# EAGLE design IOBoard-6-64 (EAGLE 4.13)
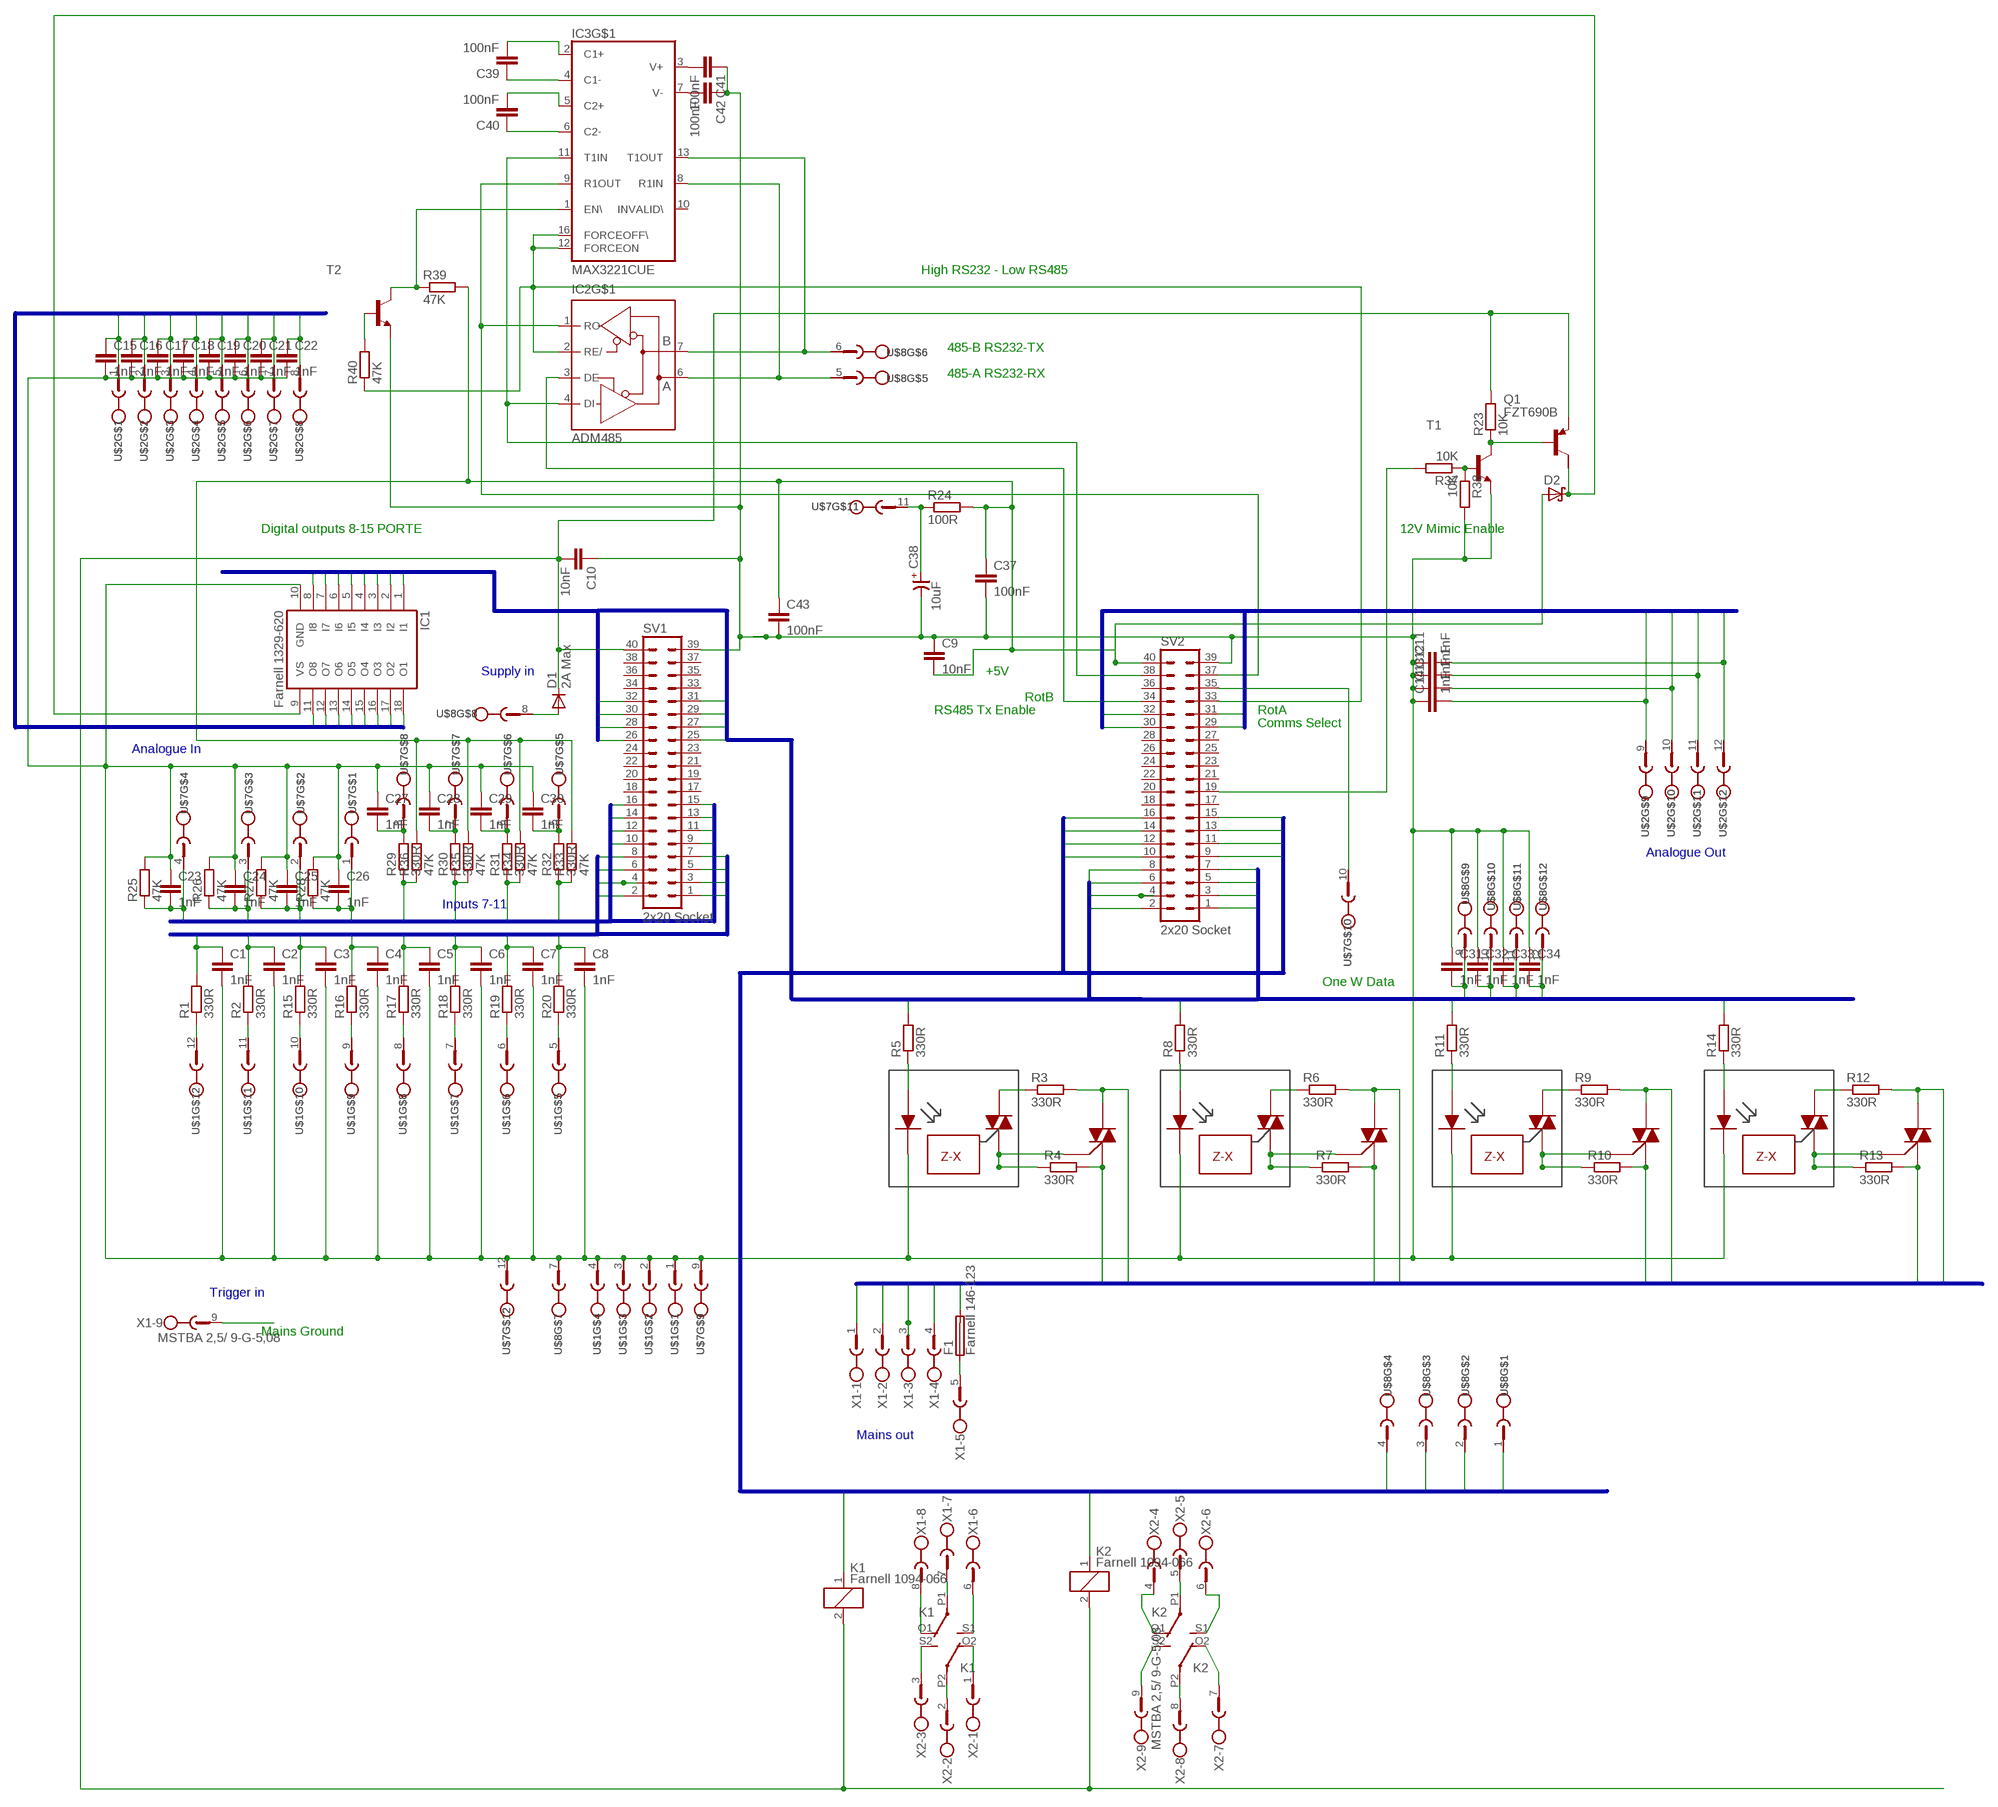
[diagram p0: schematic, sheet 1]

## Parts
C1  1nF  C-EUC1206  [C1206]
C2  1nF  C-EUC1206  [C1206]
C3  1nF  C-EUC1206  [C1206]
C4  1nF  C-EUC1206  [C1206]
C5  1nF  C-EUC1206  [C1206]
C6  1nF  C-EUC1206  [C1206]
C7  1nF  C-EUC1206  [C1206]
C8  1nF  C-EUC1206  [C1206]
C9  10nF  C-EUC1206  [C1206]
C10  10nF  C-EUC1206  [C1206]
C11  1nF  C-EUC1206  [C1206]
C12  1nF  C-EUC1206  [C1206]
C13  1nF  C-EUC1206  [C1206]
C14  1nF  C-EUC1206  [C1206]
C15  1nF  C-EUC1206  [C1206]
C16  1nF  C-EUC1206  [C1206]
C17  1nF  C-EUC1206  [C1206]
C18  1nF  C-EUC1206  [C1206]
C19  1nF  C-EUC1206  [C1206]
C20  1nF  C-EUC1206  [C1206]
C21  1nF  C-EUC1206  [C1206]
C22  1nF  C-EUC1206  [C1206]
C23  1nF  C-EUC1206  [C1206]
C24  1nF  C-EUC1206  [C1206]
C25  1nF  C-EUC1206  [C1206]
C26  1nF  C-EUC1206K  [C1206K]
C27  1nF  C-EUC1206  [C1206]
C28  1nF  C-EUC1206  [C1206]
C29  1nF  C-EUC1206  [C1206]
C30  1nF  C-EUC1206  [C1206]
C31  1nF  C-EUC1206K  [C1206K]
C32  1nF  C-EUC1206K  [C1206K]
C33  1nF  C-EUC1206K  [C1206K]
C34  1nF  C-EUC1206K  [C1206K]
C37  100nF  C-EUC1206  [C1206]
C38  10uF  CP-3216  [3216/T]
C39  100nF  C-EUC1206  [C1206]
C40  100nF  C-EUC1206  [C1206]
C41  100nF  C-EUC1206  [C1206]
C42  100nF  C-EUC1206  [C1206]
C43  100nF  C-EUC1206  [C1206]
D1  2A Max  DIODE-DO214BA  [DO-214BA]
D2  SCHOTTKY-DIODE  [SOD123]
DRV1  MOC3042  OPTRIAC  [DIL06]
DRV2  MOC3042  OPTRIAC  [DIL06]
DRV3  MOC3042  OPTRIAC  [DIL06]
DRV4  MOC3042  OPTRIAC  [DIL06]
F1  Farnell 146-123  SHK20L  [SHK20L]
IC1  Farnell 1329-620  UDN2981AD  [SO20W]
IC2  ADM485  MAX481CSA  [SO08]
IC3  MAX3221CUE  [TSSOP16]
K1  Farnell 1094-066  G2R2  [G2R2]
K2  Farnell 1094-066  G2R2  [G2R2]
Q1  FZT690B  FZT753SMD  [SOT223]
R1  330R  R-EU_M1206  [M1206]
R2  330R  R-EU_M1206  [M1206]
R3  330R  R-EU_M1206  [M1206]
R4  330R  R-EU_M1206  [M1206]
R5  330R  R-EU_M1206  [M1206]
R6  330R  R-EU_M1206  [M1206]
R7  330R  R-EU_M1206  [M1206]
R8  330R  R-EU_M1206  [M1206]
R9  330R  R-EU_M1206  [M1206]
R10  330R  R-EU_M1206  [M1206]
R11  330R  R-EU_M1206  [M1206]
R12  330R  R-EU_M1206  [M1206]
R13  330R  R-EU_M1206  [M1206]
R14  330R  R-EU_M1206  [M1206]
R15  330R  R-EU_M1206  [M1206]
R16  330R  R-EU_M1206  [M1206]
R17  330R  R-EU_M1206  [M1206]
R18  330R  R-EU_M1206  [M1206]
R19  330R  R-EU_M1206  [M1206]
R20  330R  R-EU_M1206  [M1206]
R23  10K  R-EU_R1206  [R1206]
R24  100R  R-EU_R1206  [R1206]
R25  47K  R-EU_R1206  [R1206]
R26  47K  R-EU_R1206  [R1206]
R27  47K  R-EU_R1206  [R1206]
R28  47K  R-EU_R1206  [R1206]
R29  330R  R-EU_M1206  [M1206]
R30  330R  R-EU_M1206  [M1206]
R31  330R  R-EU_M1206  [M1206]
R32  330R  R-EU_M1206  [M1206]
R33  47K  R-EU_M1206  [M1206]
R34  47K  R-EU_M1206  [M1206]
R35  47K  R-EU_M1206  [M1206]
R36  47K  R-EU_M1206  [M1206]
R37  10K  R-EU_R1206  [R1206]
R38  10K  R-EU_R1206  [R1206]
R39  47K  R-EU_R1206  [R1206]
R40  47K  R-EU_R1206  [R1206]
SV1  2x20 Socket  MA20-2  [MA20-2]
SV2  2x20 Socket  MA20-2  [MA20-2]
T1  BCW60-NPN-SOT23-BEC  [SOT23-BEC]
T2  BCW60-NPN-SOT23-BEC  [SOT23-BEC]
U$1  MC 1,5/12-G-3,5  MC123.5PITCH  [MC12-3.5]
U$2  MC 1,5/12-G-3,5  MC123.5PITCH  [MC12-3.5]
U$3  BTA08-600CW  BTA08TO220AV  [TO220AV]
U$4  BTA08-600CW  BTA08TO220AV  [TO220AV]
U$5  BTA08-600CW  BTA08TO220AV  [TO220AV]
U$6  BTA08-600CW  BTA08TO220AV  [TO220AV]
U$7  MC 1,5/12-G-3,5  MC123.5PITCH  [MC12-3.5]
U$8  MC 1,5/12-G-3,5  MC123.5PITCH  [MC12-3.5]
X1  MSTBA 2,5/ 9-G-5,08  MSTBV9  [MSTBV9]
X2  MSTBA 2,5/ 9-G-5,08  MSTBV9  [MSTBV9]

## Nets
1WIREDATA: SV2.35 U$7.10
ANALOGUEIN0: C26.2 R28.1 SV1.9 U$7.1
ANALOGUEIN1: C25.2 R27.1 SV1.10 U$7.2
ANALOGUEIN2: C24.2 R26.1 SV1.11 U$7.3
ANALOGUEIN3: C23.2 R25.1 SV1.12 U$7.4
ANOUT0: C14.2 SV2.29 U$2.9
ANOUT1: C13.2 SV2.30 U$2.10
ANOUT2: C12.2 SV2.31 U$2.11
ANOUT3: C11.2 SV2.32 U$2.12
B4FUSE [Mains in]: F1.1A X1.5
DINPUTS0: C1.1 R1.2 SV1.1
DINPUTS1: C2.1 R2.2 SV1.2
DINPUTS2: C3.1 R15.2 SV1.3
DINPUTS3: C4.1 R16.2 SV1.4
DINPUTS4: C5.1 R17.2 SV1.5
DINPUTS5: C6.1 R18.2 SV1.6
DINPUTS6: C7.1 R19.2 SV1.7
DINPUTS7: C8.1 R20.2 SV1.8
DOUTPUTS0: R5.2 SV2.1
DOUTPUTS1: R8.2 SV2.2
DOUTPUTS2: R11.2 SV2.3
DOUTPUTS3: R14.2 SV2.4
DOUTPUTS4: C34.2 SV2.5 U$8.12
DOUTPUTS5: C33.2 SV2.6 U$8.11
DOUTPUTS6: C32.2 SV2.7 U$8.10
DOUTPUTS7: C31.2 SV2.8 U$8.9
DOUTPUTS8: IC1.1(I1) SV1.25
DOUTPUTS9: IC1.2(I2) SV1.26
DOUTPUTS10: IC1.3(I3) SV1.27
DOUTPUTS11: IC1.4(I4) SV1.28
DOUTPUTS12: IC1.5(I5) SV1.29
DOUTPUTS13: IC1.6(I6) SV1.30
DOUTPUTS14: IC1.7(I7) SV1.31
DOUTPUTS15: IC1.8(I8) SV1.32
F0 [MainsPower]: R4.2 U$3.T1(MT1) X1.1
F1 [MainsPower]: R7.2 U$4.T1(MT1) X1.2
F2 [MainsPower]: R10.2 U$5.T1(MT1) X1.3
F3 [MainsPower]: R13.2 U$6.T1(MT1) X1.4
GND: C1.2 C2.2 C3.2 C4.2 C5.2 C6.2 C7.2 C8.2 C9.1 C10.1 C11.1 C12.1 C13.1 C14.1 C15.2 C16.2 C17.2 C18.2 C19.2 C20.2 C21.2 C22.2 C23.1 C24.1 C25.1 C26.1 C27.1 C28.1 C29.1 C30.1 C31.1 C32.1 C33.1 C34.1 C37.2 C38.- C41.1 C42.1 C43.2 DRV1.2(CATH) DRV2.2(CATH) DRV3.2(CATH) DRV4.2(CATH) IC1.10(GND) R25.2 R26.2 R27.2 R28.2 R38.2 SV1.39 SV2.39 T1.E T2.E U$1.1 U$1.2 U$1.3 U$1.4 U$7.9 U$7.12 U$8.7
LIVE [Mains in]: F1.2A R3.2 R6.2 R9.2 R12.2 U$3.T2(MT2) U$4.T2(MT2) U$5.T2(MT2) U$6.T2(MT2)
MGND: X1.9
MIMICS0: C15.1 IC1.18(O1) U$2.1
MIMICS1: C16.1 IC1.17(O2) U$2.2
MIMICS2: C17.1 IC1.16(O3) U$2.3
MIMICS3: C18.1 IC1.15(O4) U$2.4
MIMICS4: C19.1 IC1.14(O5) U$2.5
MIMICS5: C20.1 IC1.13(O6) U$2.6
MIMICS6: C21.1 IC1.12(O7) U$2.7
MIMICS7: C22.1 IC1.11(O8) U$2.8
N$1 [12VSupply]: D1.A U$8.8
N$2: C38.+ R24.1 U$7.11
N$3: C27.2 R29.2 U$7.8
N$4: C28.2 R30.2 U$7.7
N$5: R1.1 U$1.12
N$6: R2.1 U$1.11
N$7: C29.2 R31.2 U$7.6
N$8: C30.2 R32.2 U$7.5
N$9: R15.1 U$1.10
N$10: R16.1 U$1.9
N$11: R17.1 U$1.8
N$12: IC2.7(B) IC3.13(T1OUT) U$8.6
N$13: IC2.6(A) IC3.8(R1IN) U$8.5
N$14: R18.1 U$1.7
N$15: R19.1 U$1.6
N$16: R20.1 U$1.5
N$17: IC2.1(RO) IC3.9(R1OUT) SV2.37
N$18: IC2.4(DI) IC3.11(T1IN) SV2.38
N$19: DRV1.6(MT2) R3.1
N$20: C41.2 IC3.3(V+)
N$21: C42.2 IC3.7(V-)
N$22: C39.1 IC3.4(C1-)
N$23: DRV1.4(MT1) R4.1 U$3.G(GATE)
N$24: DRV1.1(A) R5.1
N$25: DRV2.6(MT2) R6.1
N$26: C40.1 IC3.6(C2-)
N$27: C40.2 IC3.5(C2+)
N$28: DRV2.4(MT1) R7.1 U$4.G(GATE)
N$29: DRV2.1(A) R8.1
N$30: DRV3.6(MT2) R9.1
N$31: C39.2 IC3.2(C1+)
N$32: IC2.2(RE/) IC3.12(FORCEON) IC3.16(FORCEOFF\) R40.1
N$34: DRV3.4(MT1) R10.1 U$5.G(GATE)
N$35: DRV3.1(A) R11.1
N$36: DRV4.6(MT2) R12.1
N$39: DRV4.4(MT1) R13.1 U$6.G(GATE)
N$40: DRV4.1(A) R14.1
N$41 [12VSupply]: Q1.1(B) R23.1 T1.C
N$42: R37.1 R38.1 T1.B
N$43 [5VSuppy]: D2.C IC1.9(VS) Q1.2(C)
N$44: IC3.1(EN\) R39.1 T2.C
N$45 [12VSupply]: R37.2 SV2.19
N$46: R40.2 T2.B
OC0: SV2.9 U$8.4
OC1: SV2.10 U$8.3
OC2: SV2.11 U$8.2
OC3: SV2.12 U$8.1
OC4: K1.1 SV2.13
OC5: K2.1 SV2.14
OC6: SV2.15
OC7: SV2.16
R1P1COM [Relay]: K1.P1(2:P) X1.7
R1P1NC [Relay]: K1.O1(2:O) X1.8
R1P1NO [Relay]: K1.S1(2:S) X1.6
R1P2COM [Relay]: K1.P2(3:P) X2.2
R1P2NC [Relay]: K1.O2(3:O) X2.1
R1P2NO [Relay]: K1.S2(3:S) X2.3
R2P1COM [Relay]: K2.P1(2:P) X2.5
R2P1NC [Relay]: K2.O1(2:O) X2.4
R2P1NO [Relay]: K2.S1(2:S) X2.6
R2P2COM [Relay]: K2.P2(3:P) X2.8
R2P2NC [Relay]: K2.O2(3:O) X2.7
R2P2NO [Relay]: K2.S2(3:S) X2.9
ROTA: SV2.33
ROTB: IC2.3(DE) SV2.34
SPARE0: R32.1 R33.1 SV1.13
SPARE1: R31.1 R34.1 SV1.14
SPARE2: R30.1 R35.1 SV1.15
SPARE3: R29.1 R36.1 SV1.16
V12 [12VSupply]: C10.2 D1.C K1.2 K2.2 Q1.3(E) R23.2 SV1.40
VDD [5VSuppy]: C9.2 C37.1 C43.1 D2.A R24.2 R33.2 R34.2 R35.2 R36.2 R39.2 SV2.40
Unconnected: IC3.10(INVALID\) Q1.4(C/) SV1.17 SV1.18 SV1.19 SV1.20 SV1.21 SV1.22 SV1.23 SV1.24 SV1.33 SV1.34 SV1.35 SV1.36 SV1.37 SV1.38 SV2.17 SV2.18 SV2.20 SV2.21 SV2.22 SV2.23 SV2.24 SV2.25 SV2.26 SV2.27 SV2.28 SV2.36

## Buses
MSW,LIVE,F[0..3]
DOUTPUTS[0..15]
OC[0..7]
DINPUTS[0..7]
ANOUT[0..3]
ANALOGUEIN[0..3],SPARE[0..3]
MIMICS[0..7]

## Notes on the sheet
- High RS232 - Low RS485
- 485-B RS232-TX
- 485-A RS232-RX
- Digital outputs 8-15 PORTE | 12V Mimic Enable
- Supply in | +5V
- RotB
- RS485 Tx Enable | RotA
- Comms Select
- Analogue In
- Analogue Out
- Inputs 7-11
- One W Data
- Trigger in
- Mains Ground
- Mains out

## Power pins joined to a net without a drawn wire
GND: IC2.5(GND) IC3.14(P:GND)
VDD: IC2.8(VDD) IC3.15(P:VDD)

## Library data of the parts
C1-C34 C37 C39-C43 = rcl:C-EU: CAPACITOR, European symbol
C38 = cap-master:CP-: POLARIZED CAP
D1 = diode:DIODE-: DIODE
D2 = diode:SCHOTTKY-DIODE: Schottky Diode
DRV1-DRV4 = my-optocoupler:OPTRIAC
F1 = fuse:SHK20L: FUSE HOLDER 5 x 20 mm, SH contact, SHH1 Schukat, E1073 Buerklin
IC1 = uln-udn:UDN2981A: DRIVER ARRAY
IC2 = maxim:MAX481CSA: RS485 TRANSEIVER
IC3 = maxim-8:MAX3221*: RS-232 Transceivers with AutoShutdown 1µA Supply-Current, True +3V to +5.5V http://dbserv.maxim-ic.com/
K1 K2 = relay:G2R2: RELAY 2 x switch, Omron
Q1 = transistor-pnp:FZT753SMD: PNP Transistor
R1-R20 R23-R40 = rcl:R-EU_: RESISTOR, European symbol
SV1 SV2 = con-lstb:MA20-2: PIN HEADER
T1 T2 = transistor:*-NPN-: NPN Transistror
U$1 U$2 U$7 U$8 = con-phoenix-381_l:MC12
U$3-U$6 = my-optocoupler:BTA08
X1 X2 = con-phoenix-508:MSTBV9: PHOENIX

## Net classes
1 MainsPower: width 1.524 mm, drill 0.61 mm
2 Relay: width 1.016 mm, drill 0.61 mm
3 Mains in: width 1.524 mm, drill 0.813 mm
4 12VSupply: width 0.508 mm
5 5VSuppy: width 0.305 mm

## Board
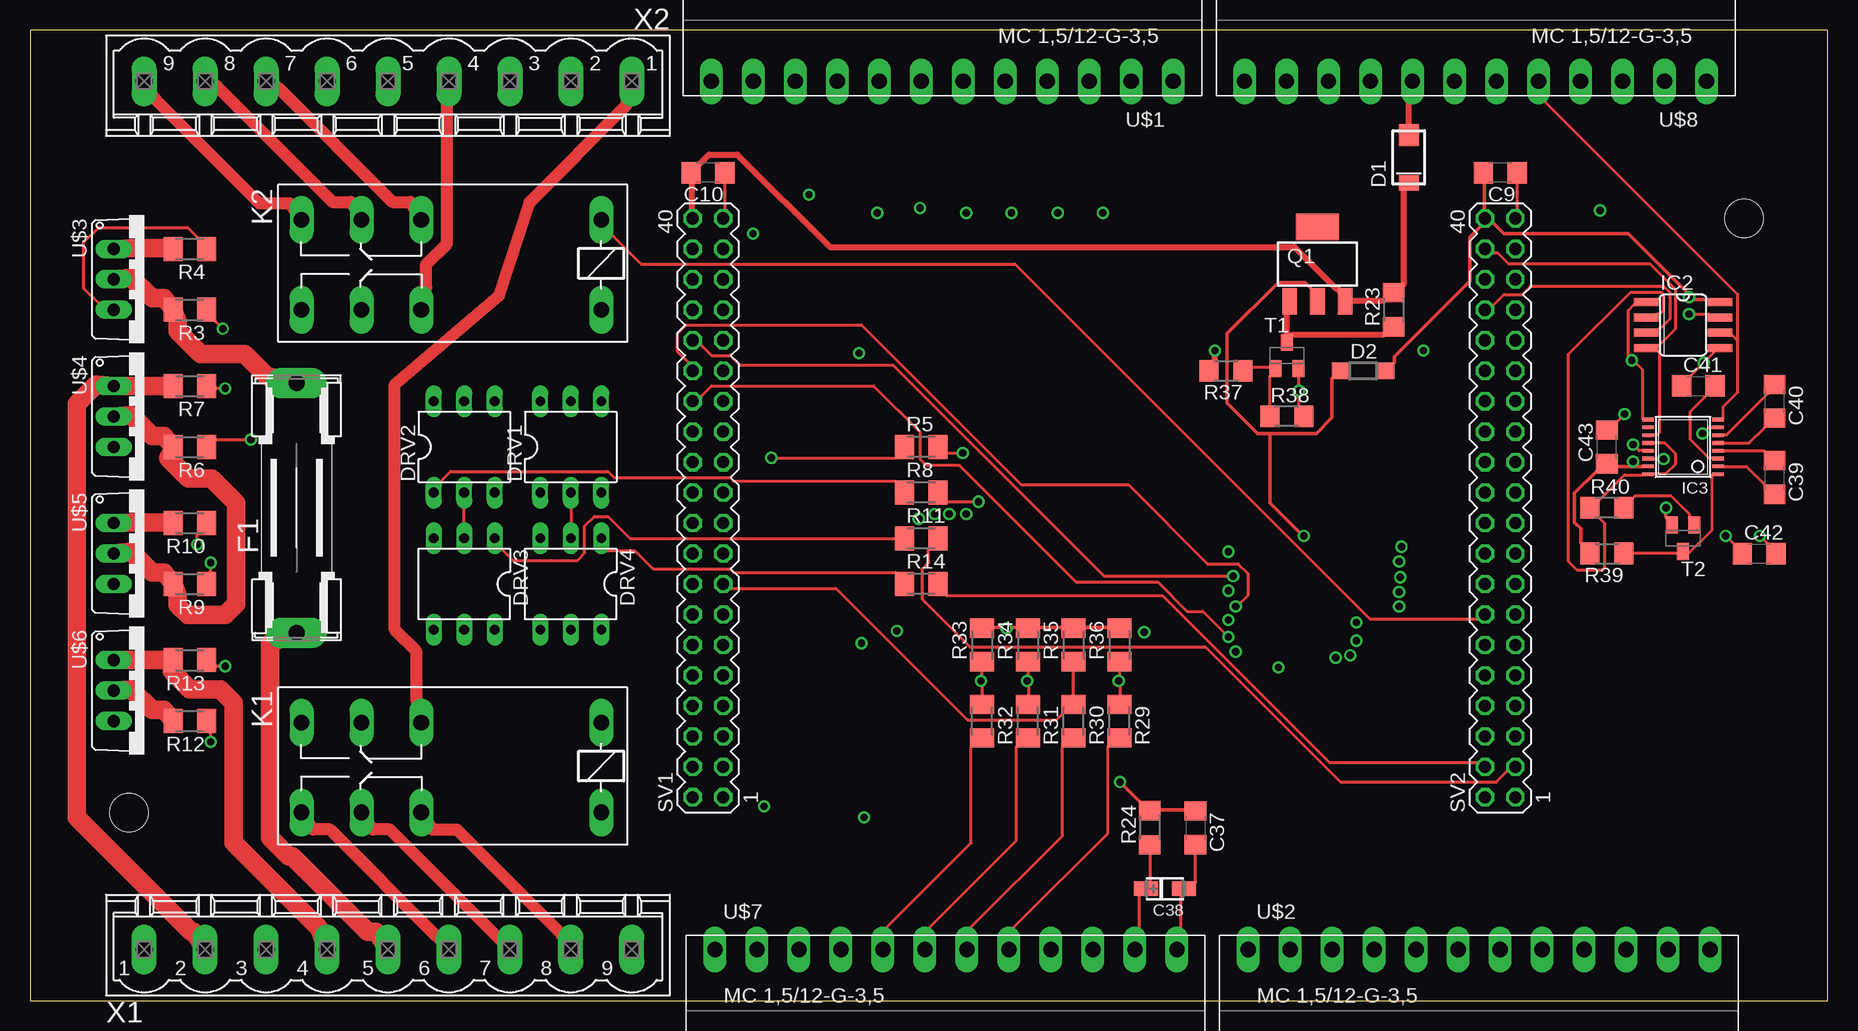
[diagram p1: board, top side]
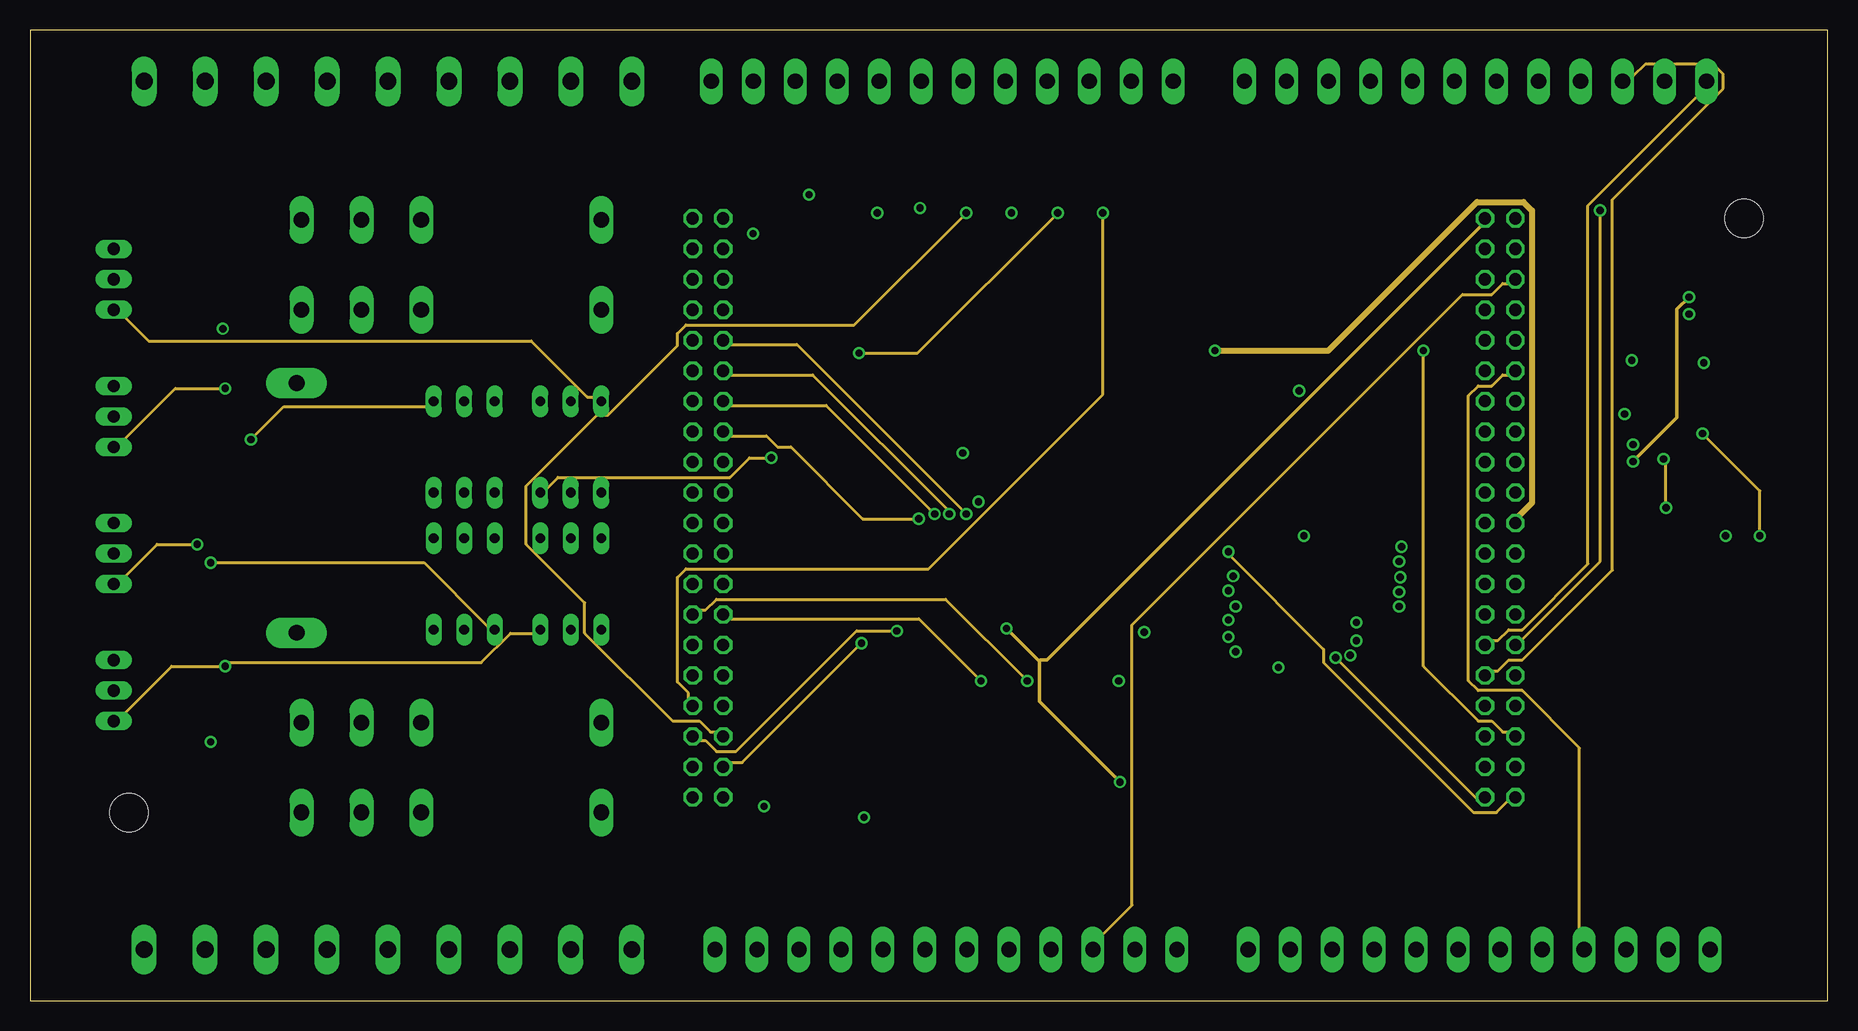
[diagram p2: board, inner layer Route2]
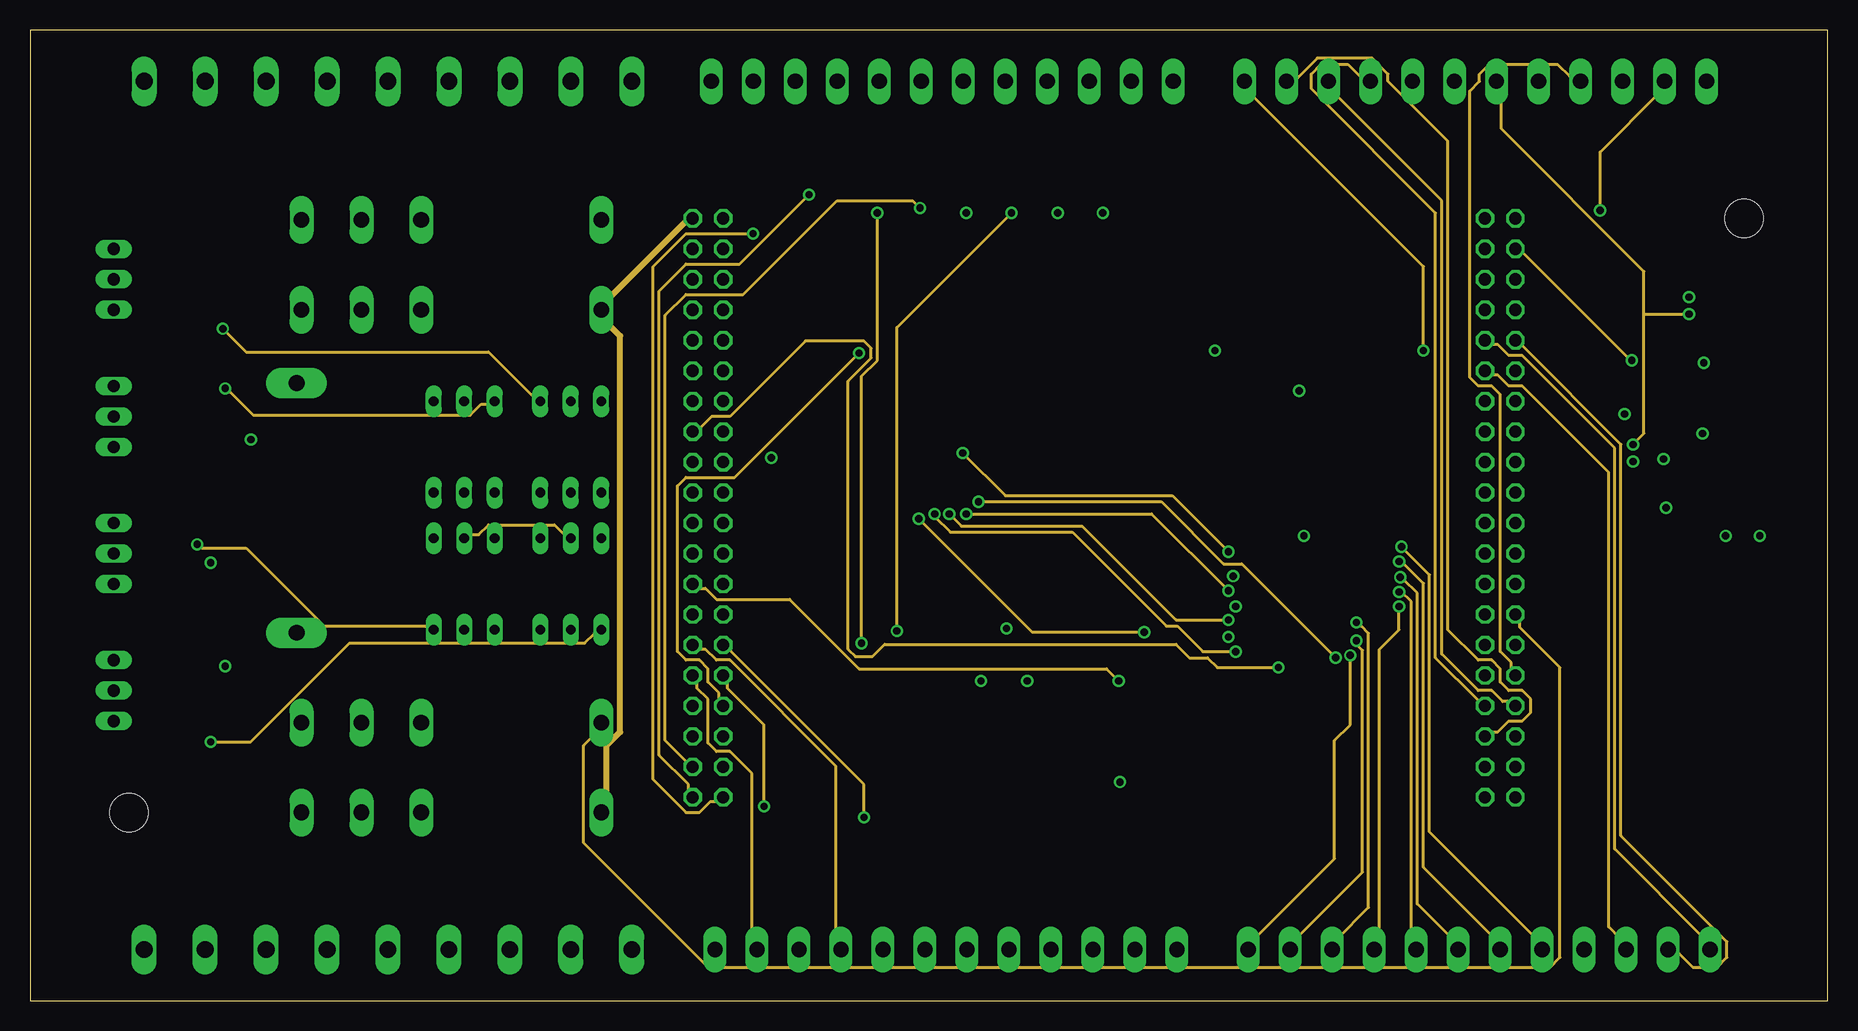
[diagram p3: board, inner layer Route15]
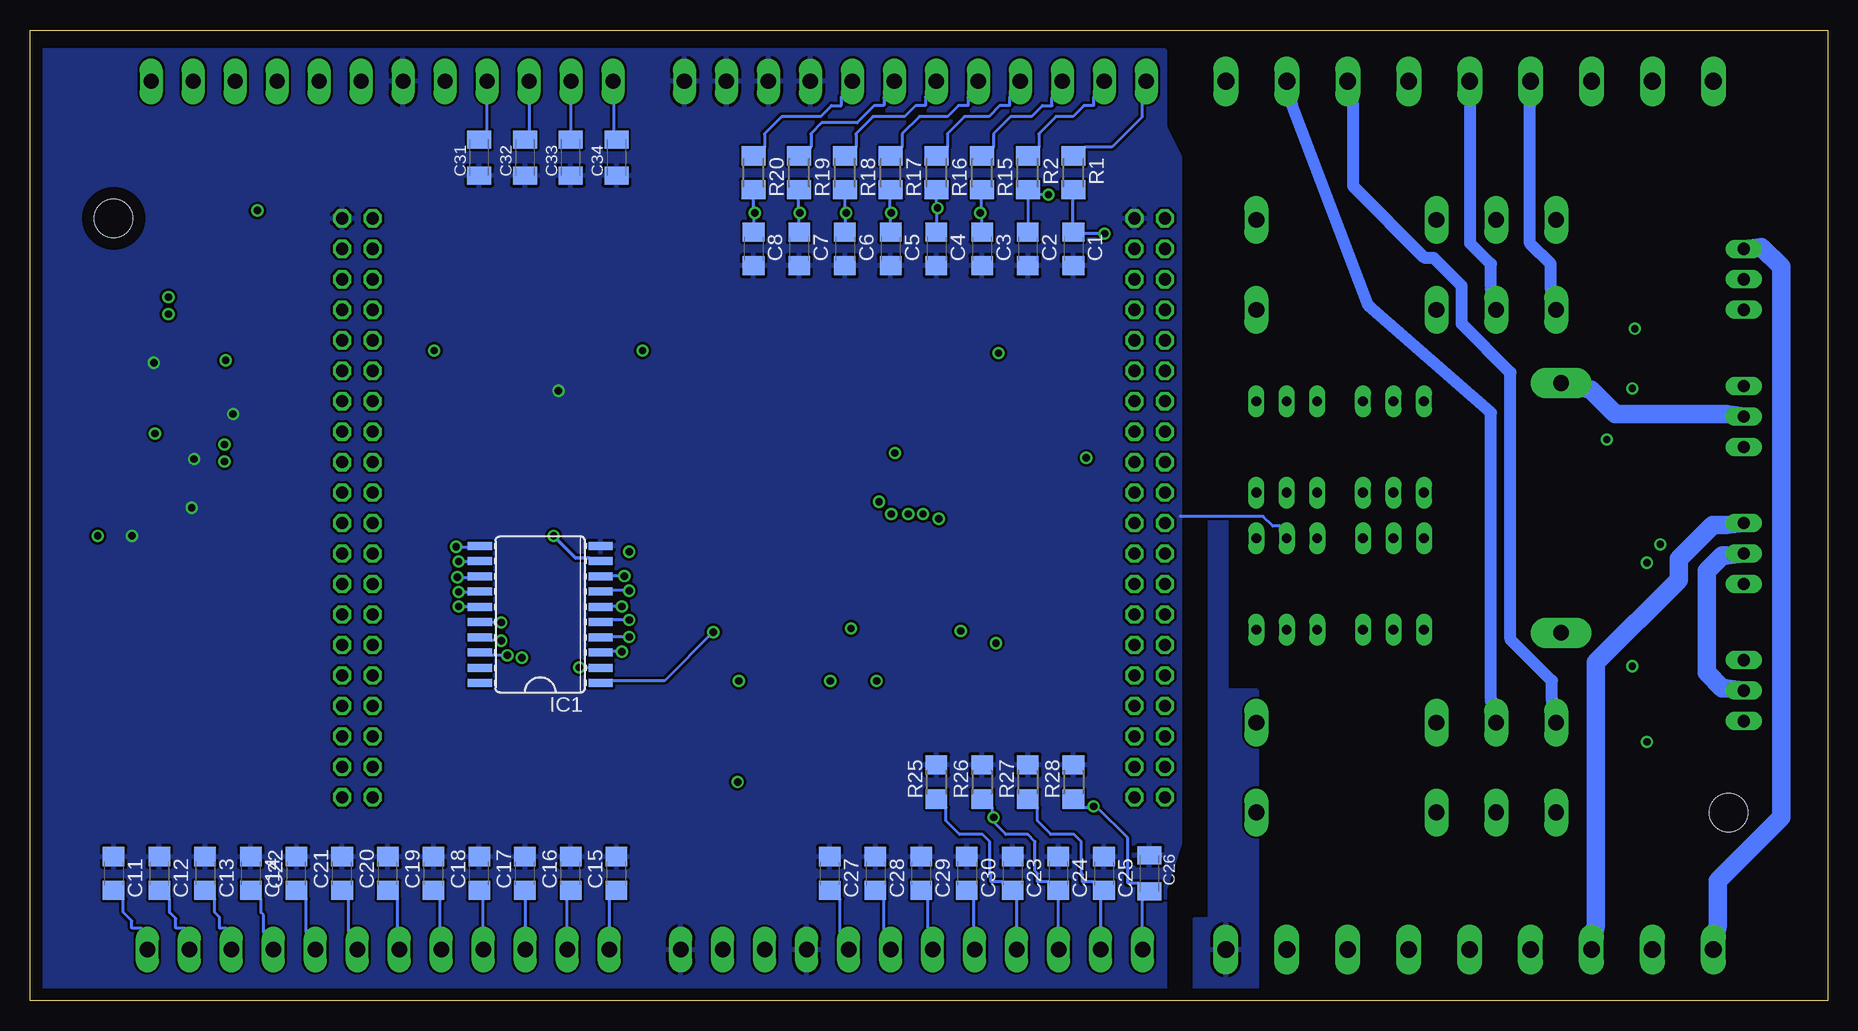
[diagram p4: board, bottom side, seen from below]

Size 149.84 x 80.95 mm. Coordinates in mm from the lower left corner, seen from the top.
Outline: 0,0 149.84,0 149.84,80.95 0,80.95 0,0
Copper layers (1*2*15*16): Top 0.035mm / dielectric 1.5mm / Route2 0.035mm / dielectric 0.15mm / Route15 0.035mm / dielectric 0.2mm / Bottom 0.035mm
Design rules "default": minimum track width 10mil, minimum drill 24mil, track to track 8mil, track to pad 12mil, pad to pad 8mil, via to via 8mil, smd to smd 8mil, copper to edge 40mil, drill to drill 8mil, minimum pad ring 10mil, minimum via ring 8mil, stop-mask expansion 4mil, vias tented up to drill 0mil, thermal gap 10mil
Holes 3.2 mm at 142.87,65.24 8.25,15.71
tKeepout: area 42.5,56.4 to 46.4,66.5
tRestrict: area 31.1,44.9 to 51.4,47.5; area 31.1,33.5 to 51.4,36
bRestrict: area 31.1,44.9 to 48.9,47.5; area 31.1,33.5 to 48.9,36

### Footprints (pad centres in the part's own frame; a part is rotated, then mirrored left to right if it is on the bottom)
C1206 = smd 1.6 x 1.8: 1 -1.4,0; 2 1.4,0
C1206K = smd 1.5 x 2: 1 -1.5,0; 2 1.5,0
3216/T = smd 2 x 1.2: + 1.587,0; - -1.587,0
DO-214BA = smd 1.85 x 1.68: A 1.87,0 | smd 1.32 x 1.68: C -2.12,0
SOD123 = smd 1.4 x 1.4: A 1.9,0; C -1.9,0
DIL06 = drill 0.813 long: 1 -2.54,-3.81; 2 0,-3.81; 3 2.54,-3.81; 4 2.54,3.81; 5 0,3.81; 6 -2.54,3.81
SHK20L = drill 1.321 pad 2.54 long: 1A -10.414,0; 2A 10.414,0
SO20W = smd 0.66 x 2.032: 1 -5.715,-5.029; 2 -4.445,-5.029; 3 -3.175,-5.029; 4 -1.905,-5.029; 5 -0.635,-5.029; 6 0.635,-5.029; 7 1.905,-5.029; 8 3.175,-5.029; 9 4.445,-5.029; 10 5.715,-5.029; 11 5.715,5.029; 12 4.445,5.029; 13 3.175,5.029; 14 1.905,5.029; 15 0.635,5.029; 16 -0.635,5.029; 17 -1.905,5.029; 18 -3.175,5.029; 19 -4.445,5.029; 20 -5.715,5.029
SO08 = smd 0.66 x 2.032: 1 -1.905,-3.073; 2 -0.635,-3.073; 3 0.635,-3.073; 4 1.905,-3.073; 5 1.905,3.073; 6 0.635,3.073; 7 -0.635,3.073; 8 -1.905,3.073
TSSOP16 = smd 0.305 x 0.991: 1 -2.275,-2.918; 2 -1.625,-2.918; 3 -0.975,-2.918; 4 -0.325,-2.918; 5 0.325,-2.918; 6 0.975,-2.918; 7 1.625,-2.918; 8 2.275,-2.918; 9 2.275,2.918; 10 1.625,2.918; 11 0.975,2.918; 12 0.325,2.918; 13 -0.325,2.918; 14 -0.975,2.918; 15 -1.625,2.918; 16 -2.275,2.918
G2R2 = drill 1.321 long: 1 -2.54,-3.683; 2 -2.54,3.81; O1 12.471,3.81; O2 12.471,-3.683; P1 17.45,3.81; P2 17.45,-3.683; S1 22.454,3.81; S2 22.454,-3.683
SOT223 = smd 1.219 x 2.235: 1 -2.311,-3.099; 2 0,-3.099; 3 2.311,-3.099 | smd 3.6 x 2.2: 4 0,3.099
M1206 = smd 1.6 x 2: 1 -1.4,0; 2 1.4,0
R1206 = smd 1.6 x 1.803: 1 -1.422,0; 2 1.422,0
MA20-2 = drill 1.016 octagon: 1 -24.13,-1.27; 2 -24.13,1.27; 3 -21.59,-1.27; 4 -21.59,1.27; 5 -19.05,-1.27; 6 -19.05,1.27; 7 -16.51,-1.27; 8 -16.51,1.27; 9 -13.97,-1.27; 10 -13.97,1.27; 11 -11.43,-1.27; 12 -11.43,1.27; 13 -8.89,-1.27; 14 -8.89,1.27; 15 -6.35,-1.27; 16 -6.35,1.27; 17 -3.81,-1.27; 18 -3.81,1.27; 19 -1.27,-1.27; 20 -1.27,1.27; 21 1.27,-1.27; 22 1.27,1.27; 23 3.81,-1.27; 24 3.81,1.27; 25 6.35,-1.27; 26 6.35,1.27; 27 8.89,-1.27; 28 8.89,1.27; 29 11.43,-1.27; 30 11.43,1.27; 31 13.97,-1.27; 32 13.97,1.27; 33 16.51,-1.27; 34 16.51,1.27; 35 19.05,-1.27; 36 19.05,1.27; 37 21.59,-1.27; 38 21.59,1.27; 39 24.13,-1.27; 40 24.13,1.27
SOT23-BEC = smd 1 x 1.4: B -0.95,-1.1; C 0,1.1; E 0.95,-1.1
MC12-3.5 = drill 1.27 long: 1 -21,0; 2 -17.5,0; 3 -14,0; 4 -10.5,0; 5 -7,0; 6 -3.5,0; 7 0,0; 8 3.5,0; 9 7,0; 10 10.5,0; 11 14,0; 12 17.5,0
TO220AV = drill 1.016 long: G 2.54,-2.54; T1 -2.54,-2.54; T2 0,-2.54
MSTBV9 = drill 1.397 long: 1 -20.32,0; 2 -15.24,0; 3 -10.16,0; 4 -5.08,0; 5 0,0; 6 5.08,0; 7 10.16,0; 8 15.24,0; 9 20.32,0

### Placement (x,y rotation side)
C1  62.86,62.7 270 bottom
C2  66.67,62.7 270 bottom
C3  70.48,62.7 270 bottom
C4  74.29,62.7 270 bottom
C5  78.1,62.7 270 bottom
C6  81.91,62.7 270 bottom
C7  85.72,62.7 270 bottom
C8  89.53,62.7 270 bottom
C9  122.55,69.05 180 top
C10  56.51,69.05 180 top
C11  142.87,10.63 270 bottom
C12  139.06,10.63 270 bottom
C13  135.25,10.63 270 bottom
C14  131.44,10.63 270 bottom
C15  100.96,10.63 90 bottom
C16  104.77,10.63 90 bottom
C17  108.58,10.63 90 bottom
C18  112.39,10.63 90 bottom
C19  116.2,10.63 90 bottom
C20  120.01,10.63 90 bottom
C21  123.82,10.63 90 bottom
C22  127.63,10.63 90 bottom
C23  67.94,10.63 270 bottom
C24  64.13,10.63 270 bottom
C25  60.32,10.63 270 bottom
C26  56.51,10.63 270 bottom
C27  83.18,10.63 270 bottom
C28  79.37,10.63 270 bottom
C29  75.56,10.63 270 bottom
C30  71.75,10.63 270 bottom
C31  112.39,70.32 90 bottom
C32  108.58,70.32 90 bottom
C33  104.77,70.32 90 bottom
C34  100.96,70.32 90 bottom
C37  97.15,14.44 270 top
C38  94.61,9.36 180 top
C39  145.41,43.65 270 top
C40  145.41,50 270 top
C41  139.06,51.27 0 top
C42  144.14,37.3 0 top
C43  131.44,46.19 90 top
D1  114.93,70.32 90 top
D2  111.12,52.54 0 top
DRV1  45.08,46.19 0 top
DRV2  36.19,46.19 0 top
DRV3  36.19,34.76 180 top
DRV4  45.08,34.76 180 top
F1  22.22,41.11 90 top
IC1  107.31,32.22 90 bottom
IC2  137.79,56.35 270 top
IC3  137.79,46.19 90 top
K1  45.08,19.52 180 top
K2  45.08,61.43 180 top
Q1  107.31,61.43 0 top
R1  62.86,69.05 270 bottom
R2  66.67,69.05 270 bottom
R3  13.33,57.62 180 top
R4  13.33,62.7 180 top
R5  74.29,46.19 0 top
R6  13.33,46.19 180 top
R7  13.33,51.27 180 top
R8  74.29,42.38 0 top
R9  13.33,34.76 180 top
R10  13.33,39.84 180 top
R11  74.29,38.57 0 top
R12  13.33,23.33 180 top
R13  13.33,28.41 180 top
R14  74.29,34.76 0 top
R15  70.48,69.05 270 bottom
R16  74.29,69.05 270 bottom
R17  78.1,69.05 270 bottom
R18  81.91,69.05 270 bottom
R19  85.72,69.05 270 bottom
R20  89.53,69.05 270 bottom
R23  113.66,57.62 90 top
R24  93.34,14.44 90 top
R25  74.29,18.25 90 bottom
R26  70.48,18.25 90 bottom
R27  66.67,18.25 90 bottom
R28  62.86,18.25 90 bottom
R29  90.8,23.33 270 top
R30  86.99,23.33 270 top
R31  83.18,23.33 270 top
R32  79.37,23.33 270 top
R33  79.37,29.68 90 top
R34  83.18,29.68 90 top
R35  86.99,29.68 90 top
R36  90.8,29.68 90 top
R37  99.69,52.54 180 top
R38  104.77,48.73 0 top
R39  131.44,37.3 180 top
R40  131.44,41.11 0 top
SV1  56.51,41.11 90 top
SV2  122.55,41.11 90 top
T1  104.77,53.81 0 top
T2  137.79,38.57 180 top
U$1  74.29,76.67 180 top
U$2  122.55,4.28 0 top
U$3  9.52,60.16 270 top
U$4  9.52,48.73 270 top
U$5  9.52,37.3 270 top
U$6  9.52,25.87 270 top
U$7  78.1,4.28 0 top
U$8  118.74,76.67 180 top
X1  29.84,4.28 0 top
X2  29.84,76.67 180 top

### Tracks (layer width: path | path; a pad name or v marks a point on that pad's centre or on a via)
1WIREDATA
  Route2 0.254: SV2.35 123.16,59.8 122.75,59.8 121.84,58.89 119.4,58.89 91.87,31.36 91.87,7.99 89.02,5.14 U$7.10
ANALOGUEIN0  (via drill 0.61)
  Route15 0.254: v61.18,16.22 61.18,23.02 58.14,26.07 58.14,26.48 SV1.9
  Bottom 0.254: 61.18,16.12 60.88,16.12 58.34,13.58 58.34,9.82 57.42,9.82 C26.2 57.12,8.39 57.12,6.16 U$7.1 | 61.18,16.12 62,16.12 R28.1 | 61.18,16.12 v61.18,16.22
ANALOGUEIN1
  Route15 0.254: SV1.10 55.6,26.48 55.6,26.07 56.51,25.16 56.51,21.5 57.22,20.79 58.34,20.79 60.17,18.96 60.17,5.14 U$7.2
  Bottom 0.254: U$7.2 60.57,6.16 60.57,8.5 C25.2 61.18,9.92 62.1,9.92 62.1,10.53 62.2,10.63 62.2,13.27 62.81,13.88 64.74,13.88 65.86,15 65.86,16.12 R27.1
ANALOGUEIN2  (via drill 0.61)
  Route15 0.254: v69.52,15.3 69.52,18.05 58.34,29.22 SV1.11
  Bottom 0.254: U$7.3 64.13,6.16 C24.2 64.94,9.92 65.86,9.92 65.86,10.63 66.06,10.83 66.06,13.27 66.67,13.88 68.5,13.88 69.62,15 69.62,15.3 | 69.62,15.3 69.62,16.12 R26.1 | 69.62,15.3 v69.52,15.3
ANALOGUEIN3
  Route15 0.254: SV1.12 55.9,29.32 56.31,29.32 57.22,28.41 58.34,28.41 67.18,19.57 67.18,5.14 U$7.4
  Bottom 0.254: U$7.4 67.58,6.16 67.58,8.5 C23.2 68.8,9.92 69.72,9.92 69.72,10.53 69.82,10.63 69.82,13.27 70.43,13.88 72.36,13.88 73.48,15 73.48,16.12 R25.1
ANOUT0
  Route2 0.254: SV2.29 123.16,52.18 122.75,52.18 121.84,51.27 120.72,51.27 119.91,50.46 119.91,26.68 120.72,25.87 124.38,25.87 129.15,21.09 129.15,5.14 U$2.9
  Bottom 0.254: C14.2 130.58,8.5 130.58,7.38 130.37,7.18 130.37,5.75 U$2.9
ANOUT1
  Route15 0.254: SV2.30 121.94,52.18 122.35,52.18 123.26,51.27 124.38,51.27 131.59,44.06 131.59,6.16 132.61,5.14 U$2.10
  Bottom 0.254: C13.2 134.44,8.5 134.44,7.38 134.03,6.97 134.03,6.06 133.52,6.06 U$2.10
ANOUT2
  Route15 0.254: SV2.31 124.38,54.62 132.61,46.39 132.61,13.78 141.45,4.94 141.45,3.62 140.63,2.81 138.6,2.81 137.48,3.92 U$2.11
  Bottom 0.254: C12.2 138.2,8.5 138.2,7.38 137.69,6.87 137.69,6.06 136.98,6.06 U$2.11
ANOUT3
  Route15 0.254: SV2.32 121.94,54.72 122.35,54.72 123.26,53.81 124.38,53.81 132.1,46.09 132.1,12.66 139.62,5.14 U$2.12
  Bottom 0.254: C11.2 142.06,8.5 142.06,7.38 141.35,6.67 141.35,6.06 140.53,6.06 U$2.12
B4FUSE
  Top 1.524: X1.5 28.88,5.75 28.16,5.75 21.86,12.05 21.56,12.05 20.04,13.58 20.04,29.83 F1.1A
DINPUTS0  (via drill 0.61)
  Route15 0.254: v60.27,63.97 54.68,63.97 51.94,61.23 51.94,18.45 54.68,15.71 55.8,15.71 56.71,16.62 57.12,16.62 SV1.1
  Bottom 0.254: R1.2 62.91,66.92 62.91,64.88 C1.1 62,63.97 v60.27,63.97
DINPUTS1  (via drill 0.61)
  Route15 0.254: v64.94,67.22 59.15,61.43 54.68,61.43 52.45,59.2 52.45,20.48 54.88,18.05 54.88,17.64 SV1.2
  Bottom 0.254: C2.1 R2.2 65.76,67.22 v64.94,67.22
DINPUTS2  (via drill 0.61)
  Route2 0.254: v69.31,29.83 59.36,19.88 58.44,19.88 SV1.3
  Route15 0.254: v69.31,29.83 69.31,52.08 70.63,53.4 v70.63,65.7
  Bottom 0.254: 70.53,65.7 70.53,66.92 R15.2 | 70.53,65.7 70.53,64.88 C3.1 | v70.63,65.7 70.53,65.7
DINPUTS3  (via drill 0.61)
  Route15 0.254: v74.19,66.1 73.58,66.71 67.28,66.71 59.46,58.89 54.68,58.89 52.95,57.16 52.95,21.7 54.68,19.98 SV1.4
  Bottom 0.254: 74.29,66.1 C4.1 | 74.29,66.1 R16.2 | v74.19,66.1 74.29,66.1
DINPUTS4  (via drill 0.61)
  Route2 0.254: v78.05,65.7 68.7,56.35 54.68,56.35 53.97,55.64 53.97,54.62 48.18,48.83 47.26,48.83 41.37,42.94 41.37,38.06 46.25,33.19 46.25,30.64 53.56,23.33 55.8,23.33 56.71,22.42 57.12,22.42 SV1.5
  Bottom 0.254: 78.15,65.7 78.15,66.92 R17.2 | 78.15,65.7 78.15,64.88 C5.1 | v78.05,65.7 78.15,65.7
DINPUTS5  (via drill 0.61)
  Route2 0.254: v72.26,30.85 68.91,30.85 58.85,20.79 57.22,20.79 56.31,21.7 55.9,21.7 SV1.6
  Route15 0.254: v72.26,30.85 72.26,56.15 v81.81,65.7
  Bottom 0.254: 81.91,65.7 C6.1 | 81.91,65.7 R18.2 | v81.81,65.7 81.91,65.7
DINPUTS6  (via drill 0.61)
  Route2 0.254: v69.11,54.01 73.98,54.01 v85.67,65.7
  Route15 0.254: v69.11,54.01 58.75,43.65 54.68,43.65 53.97,42.94 53.97,29.12 54.68,28.41 55.8,28.41 56.51,27.7 56.51,26.58 57.42,25.67 57.42,25.26 SV1.7
  Bottom 0.254: 85.77,65.7 85.77,66.92 R19.2 | 85.77,65.7 85.77,64.88 C7.1 | v85.67,65.7 85.77,65.7
DINPUTS7  (via drill 0.61)
  Route2 0.254: v89.43,65.7 89.43,50.56 74.9,36.03 54.68,36.03 53.97,35.32 53.97,26.58 54.88,25.67 54.88,25.26 SV1.8
  Bottom 0.254: 89.53,65.7 C8.1 | 89.53,65.7 R20.2 | v89.43,65.7 89.53,65.7
DOUTPUTS0  (via drill 0.61)
  Top 0.254: v77.74,45.68 76.42,45.68 R5.2
  Route2 0.254: v99.89,37.45 99.89,37.25 107.82,29.32 107.82,28.21 120.31,15.71 122.24,15.71 123.16,16.62 SV2.1
  Route15 0.254: v77.74,45.68 81.3,42.13 95.22,42.13 v99.89,37.45
DOUTPUTS1  (via drill 0.61)
  Top 0.254: v79.06,41.62 76.42,41.62 R8.2
  Route2 0.254: v108.83,28.61 120.62,16.83 SV2.2
  Route15 0.254: v79.06,41.62 94.3,41.62 99.49,36.44 101.01,36.44 v108.83,28.61
DOUTPUTS2
  Top 0.254: R11.2 74.9,37.66 74.9,36.54 74.39,36.03 74.39,33.49 78.35,29.53 97.96,29.53 109.24,18.25 122.24,18.25 123.16,19.16 SV2.3
DOUTPUTS3
  Top 0.254: R14.2 76.42,33.8 94.41,33.8 108.33,19.88 120.62,19.88 SV2.4
DOUTPUTS4  (via drill 0.61)
  Route2 0.254: v116.15,54.22 116.15,27.9 120.72,23.33 121.84,23.33 122.75,22.42 123.16,22.42 SV2.5
  Route15 0.254: v116.15,54.22 116.15,61.23 101.62,75.76 U$8.12
  Bottom 0.254: C34.2 101.21,72.5 101.21,74.84 U$8.12
DOUTPUTS5
  Route15 0.254: SV2.6 121.94,22.42 122.35,22.42 123.26,23.33 124.38,23.33 125.09,24.04 125.09,25.16 124.38,25.87 123.26,25.87 122.55,26.58 122.55,27.7 121.84,28.41 120.72,28.41 118.18,30.95 118.18,71.69 113.2,76.67 113.2,77.28 111.88,78.6 107.31,78.6 105.68,76.97 U$8.11
  Bottom 0.254: C33.2 104.77,74.84 U$8.11
DOUTPUTS6
  Route15 0.254: SV2.7 123.16,24.96 122.75,24.96 121.84,25.87 120.72,25.87 117.67,28.92 117.67,66.71 108.63,75.76 U$8.10
  Bottom 0.254: C32.2 108.22,72.5 108.22,74.84 U$8.10
DOUTPUTS7
  Route15 0.254: SV2.8 120.72,25.06 117.16,28.61 117.16,65.7 106.8,76.06 106.8,77.28 107.61,78.09 109.85,78.09 110.87,77.08 U$8.9
  Bottom 0.254: C31.2 111.78,72.5 111.78,74.84 U$8.9
DOUTPUTS8  (via drill 0.61)
  Route2 0.254: v74.09,40.2 69.41,40.2 63.42,46.19 62.3,46.19 61.39,47.1 58.44,47.1 SV1.25
  Route15 0.254: v92.88,30.75 83.54,30.75 v74.09,40.2
  Bottom 0.254: v92.88,30.75 96.95,26.68 101.32,26.68 IC1.1
DOUTPUTS9  (via drill 0.61)
  Route15 0.254: v104.06,27.8 98.98,27.8 98.17,28.61 96.64,28.61 95.52,29.73 71.24,29.73 70.23,28.71 68.8,28.71 68.19,29.32 68.19,51.68 70.12,53.61 70.12,54.42 69.52,55.03 64.64,55.03 58.34,48.73 56.82,48.73 55.9,47.82 SV1.26
  Bottom 0.254: v104.06,27.8 103.25,27.8 IC1.2
DOUTPUTS10  (via drill 0.61)
  Route2 0.254: v75.41,40.6 66.36,49.64 58.44,49.64 SV1.27
  Route15 0.254: v100.5,29.12 97.76,29.12 95.63,31.25 94.71,31.25 86.89,39.08 76.73,39.08 75.41,40.4 v75.41,40.6
  Bottom 0.254: v100.5,29.12 101.32,29.12 IC1.3
DOUTPUTS11  (via drill 0.61)
  Top 0.254: v99.89,30.34 97.76,32.47 96.44,32.47 94,34.91 87.19,34.91 77.44,44.67 74.7,44.67 74.19,45.17 74.19,47.41 70.33,51.27 56.82,51.27 55.9,50.36 SV1.28
  Bottom 0.254: v99.89,30.34 101.32,30.34 IC1.4
DOUTPUTS12  (via drill 0.61)
  Route2 0.254: v76.63,40.6 76.63,40.8 65.25,52.18 58.44,52.18 SV1.29
  Route15 0.254: v99.89,31.76 95.52,31.76 87.7,39.59 77.64,39.59 v76.63,40.6
  Bottom 0.254: v99.89,31.76 101.32,31.76 IC1.5
DOUTPUTS13  (via drill 0.61)
  Top 0.254: v100.5,32.88 100.81,33.19 100.91,33.19 101.52,33.8 101.52,35.62 100.71,36.44 98.17,36.44 91.56,43.04 82.62,43.04 69.31,56.35 54.68,56.35 53.97,55.64 53.97,54.12 54.88,53.2 SV1.30
  Bottom 0.254: v100.5,32.88 101.32,32.88 IC1.6
DOUTPUTS14  (via drill 0.61)
  Route2 0.254: v78.05,40.6 63.93,54.72 58.44,54.72 SV1.31
  Route15 0.254: v99.89,34.2 93.49,40.6 v78.05,40.6
  Bottom 0.254: v99.89,34.2 101.32,34.2 IC1.7
DOUTPUTS15  (via drill 0.61)
  Top 0.254: v100.3,35.42 89.53,35.42 71.95,53 59.15,53 58.34,53.81 56.82,53.81 55.9,54.72 SV1.32
  Bottom 0.254: v100.3,35.42 101.32,35.42 IC1.8
F0
  Top 1.524: R4.2 11.2,62.75 8.45,62.75 U$3.T1
  Bottom 1.524: X1.1 9.16,6.36 9.16,10.02 3.88,15.3 3.88,61.23 5.51,62.85 U$3.T1
F1
  Top 1.524: R7.2 U$4.T1 5.51,51.37 3.88,49.75 3.88,15.3 13.43,5.75 13.64,5.75 X1.2
F2
  Top 1.524: R10.2 11.2,39.89 8.45,39.89 U$5.T1
  Bottom 1.524: X1.3 19.32,6.36 19.32,28.21 12.42,35.12 12.42,36.84 9.57,39.69 8.45,39.69 U$5.T1
F3
  Top 1.524: U$6.T1 R13.2 11.81,27.5 13.33,25.97 15.87,25.97 16.99,24.85 16.99,13.17 24.1,6.06 X1.4
GND  (via drill 0.61)
  Top 0.254: DRV3.2 DRV2.2 | DRV4.2 45.13,39.79 45.13,41.11 DRV1.2 | C41.1 138.4,52.08 v139.52,53.2 140.53,54.22 IC2.5 | C37.2 97.15,9.92 C38.- 95.93,8.8 95.93,6.16 U$7.12 | T1.E 105.79,52.08 v105.79,50.86 105.79,49.54 R38.2 | v136.16,45.17 135.35,45.17 IC3.14 | v136.37,41.11 136.37,40.3 T2.E | C10.1 57.93,68.24 57.93,65.9 SV1.39 | v141.35,38.77 141.96,38.16 C42.1 | v132.91,48.93 132.3,48.32 C43.2 | C9.1 123.97,68.24 123.97,65.9 SV2.39
  Route2 0.254: v136.37,41.11 136.37,44.77 v136.16,45.17
  Route15 0.254: DRV3.2 36.8,38.88 37.41,38.88 38.22,39.69 43.71,39.69 44.52,38.88 DRV4.2
  Bottom 0.254: DRV4.2 45.64,39.59 46.25,39.59 47.06,40.4 53.97,40.4
  pour Bottom: 55.24,0.47 55.24,9.36 53.97,13.17 53.97,70.32 55.24,72.86 55.24,79.21 149.22,79.21 149.22,0.47 102.23,0.47 103.5,0.47
LIVE
  Top 1.524: R12.2 11.2,24.24 10.18,24.24 8.45,25.97 U$6.T2 | U$5.T2 8.45,37.45 10.18,35.73 11.2,35.73 R9.2 12.31,33.8 12.31,32.98 13.13,32.17 16.28,32.17 17.19,33.08 17.19,41.52 15.16,43.55 13.23,43.55 11.5,45.28 R6.2 11.2,47.1 10.18,47.1 8.45,48.83 U$4.T2 | U$3.T2 8.45,60.31 10.18,58.59 11.2,58.59 R3.2 12.31,56.66 12.31,55.84 14.24,53.91 17.9,53.91 19.73,52.08 F1.2A
  Bottom 1.524: U$6.T2 8.45,26.07 8.76,26.07 10.08,27.39 10.08,35.83 8.76,37.15 8.45,37.15 U$5.T2 | U$4.T2 8.45,48.93 17.7,48.93 19.73,50.96 F1.2A
MGND
  pour Bottom: 47.62,0.47 52.7,0.47 52.7,6.82 51.43,6.82 51.43,67.78 47.62,67.78 47.62,55.08 50.16,55.08 50.16,25.87 47.62,25.87 47.62,0.47 50.16,0.47
MIMICS0  (via drill 0.61)
  Route15 0.254: v110.05,28.82 110.05,23.02 108.73,21.7 108.73,11.85 102.03,5.14 U$2.1
  Bottom 0.254: C15.1 101.52,8.5 101.52,6.16 U$2.1 | v110.05,28.82 111.37,28.82 IC1.18
MIMICS1  (via drill 0.61)
  Route15 0.254: v110.56,30.04 110.56,29.73 111.07,29.22 111.07,10.73 105.48,5.14 U$2.2
  Bottom 0.254: C16.1 105.07,8.5 105.07,6.16 U$2.2 | v110.56,30.04 111.37,30.04 IC1.17
MIMICS2  (via drill 0.61)
  Route15 0.254: v110.56,31.56 110.87,31.25 110.97,31.25 111.58,30.64 111.58,7.79 108.94,5.14 U$2.3
  Bottom 0.254: C17.1 108.53,8.5 108.53,6.16 U$2.3 | v110.56,31.56 111.37,31.56 IC1.16
MIMICS3  (via drill 0.61)
  Route15 0.254: v114.12,32.88 114.12,30.95 112.49,29.32 112.49,5.14 U$2.4
  Bottom 0.254: C18.1 112.08,8.5 112.08,6.16 U$2.4 | v114.12,32.88 113.3,32.88 IC1.15
MIMICS4  (via drill 0.61)
  Route15 0.254: v114.12,34.1 114.32,34.1 115.13,33.29 115.13,5.14 U$2.5
  Bottom 0.254: C19.1 115.64,8.5 115.64,6.16 U$2.5 | v114.12,34.1 113.3,34.1 IC1.14
MIMICS5  (via drill 0.61)
  Route15 0.254: v114.22,35.32 114.42,35.12 114.52,35.12 115.64,34 115.64,8.09 118.59,5.14 U$2.6
  Bottom 0.254: C20.1 119.2,8.5 119.2,6.16 U$2.6 | v114.22,35.32 113.3,35.32 IC1.13
MIMICS6  (via drill 0.61)
  Route15 0.254: v114.12,36.64 114.32,36.64 116.15,34.81 116.15,11.14 122.14,5.14 U$2.7
  Bottom 0.254: C21.1 123.26,8.5 123.26,5.85 U$2.7 | v114.12,36.64 113.3,36.64 IC1.12
MIMICS7  (via drill 0.61)
  Route15 0.254: v114.32,37.86 116.66,35.52 116.66,14.08 125.6,5.14 U$2.8
  Bottom 0.254: C22.1 126.82,8.5 126.82,5.75 U$2.8 | v114.32,37.86 113.3,37.86 IC1.11
N$1
  Top 0.508: D1.A 114.93,74.84 U$8.8
N$2
  Top 0.254: R24.1 93.39,12.26 93.39,9.92 C38.+ 92.48,8.8 92.48,6.16 U$7.11
N$3
  Top 0.254: R29.2 89.83,21.2 89.83,13.98 82.01,6.16 U$7.8
  Bottom 0.254: C27.2 82.32,8.5 82.32,5.85 U$7.8
N$4
  Top 0.254: R30.2 86.08,21.2 86.08,13.78 78.46,6.16 U$7.7
  Bottom 0.254: C28.2 78.66,8.5 78.66,5.96 U$7.7
N$5
  Bottom 0.254: R1.1 61.9,71.18 59.66,71.18 57.12,73.72 57.12,74.84 U$1.12
N$6
  Bottom 0.254: R2.1 65.76,71.18 65.76,72.3 64.33,73.72 62.91,73.72 62,74.64 61.18,74.64 61.18,75.35 U$1.11
N$7
  Top 0.254: R31.2 82.21,21.2 82.21,13.37 75,6.16 U$7.6
  Bottom 0.254: C29.2 75,8.5 75,6.16 U$7.6
N$8
  Top 0.254: R32.2 78.46,21.2 78.46,13.17 71.44,6.16 U$7.5
  Bottom 0.254: C30.2 71.14,8.5 71.14,6.16 U$7.5
N$9
  Bottom 0.254: R15.1 69.52,71.18 69.52,72.3 68.09,73.72 66.36,73.72 65.45,74.64 64.64,74.64 64.64,75.25 U$1.10
N$10
  Bottom 0.254: R16.1 73.38,71.18 73.38,72.3 71.95,73.72 69.92,73.72 69.01,74.64 68.19,74.64 68.19,75.35 U$1.9
N$11
  Bottom 0.254: R17.1 77.13,71.18 77.13,72.3 75.71,73.72 73.38,73.72 72.46,74.64 71.65,74.64 71.65,75.25 U$1.8
N$12  (via drill 0.61)
  Top 0.254: v133.62,46.39 134.13,45.88 134.44,45.88 IC3.13 | v138.3,57.26 139.92,57.26 IC2.7
  Route15 0.254: v133.62,46.39 134.54,47.31 134.54,57.26 | 134.54,57.26 134.54,60.82 122.65,72.71 122.65,75.76 U$8.6 | 134.54,57.26 v138.3,57.26
N$13
  Top 0.254: 142.36,55.03 142.36,50.76 141.14,49.54 141.14,48.53 IC3.8 | 142.36,55.03 141.85,55.54 IC2.6 | U$8.5 126.31,74.94 142.36,58.89 142.36,55.03
N$14
  Bottom 0.254: R18.1 81,71.18 81,72.3 79.57,73.72 76.93,73.72 76.02,74.64 75.2,74.64 75.2,75.35 U$1.7
N$15
  Bottom 0.254: R19.1 84.75,71.18 84.75,72.3 83.84,73.22 80.89,73.22 79.47,74.64 78.66,74.64 78.66,75.25 U$1.6
N$16
  Bottom 0.254: R20.1 88.62,71.18 88.62,72.3 87.19,73.72 83.94,73.72 83.03,74.64 82.21,74.64 82.21,75.35 U$1.5
N$17  (via drill 0.61)
  Top 0.254: 133.57,53.45 133.22,53.81 133.22,57.57 133.73,58.08 IC2.1 | 133.57,53.45 134.44,52.59 134.44,48.53 IC3.9 | 133.57,53.45 v133.52,53.4
  Route15 0.254: v133.52,53.4 133.42,53.4 124.48,62.34 SV2.37
N$18
  Top 0.254: IC3.11 135.35,47.21 135.66,47.21 135.86,47.41 135.86,54.01 135.66,54.22 IC2.4 135.66,54.52 137.18,56.05 137.18,59.3 135.05,61.43 123.26,61.43 122.35,62.34 121.94,62.34 SV2.38
N$19  (via drill 0.61)
  Top 0.254: v16.07,56.05 15.46,56.66 R3.1
  Route15 0.254: v16.07,56.05 18,54.12 38.22,54.12 41.98,50.36 DRV1.6
N$20
  Top 0.254: IC3.3 140.23,45.28 139.92,45.28 138.4,46.8 138.4,49.14 139.72,50.46 C41.2
N$21  (via drill 0.61)
  Top 0.254: v139.42,47.31 139.92,47.82 140.23,47.82 IC3.7 | v144.19,38.77 144.8,38.16 C42.2
  Route2 0.254: v139.42,47.31 144.19,42.53 v144.19,38.77
N$22
  Top 0.254: IC3.4 141.14,45.88 144.5,45.88 144.6,45.78 C39.1
N$23
  Top 0.254: R4.1 13.94,63.66 13.13,64.48 5.71,64.48 4.49,63.26 4.49,59.4 5.71,58.18 U$3.G
  Route2 0.254: DRV1.4 47.06,50.36 46.45,50.36 41.78,55.03 9.88,55.03 7.64,57.26 U$3.G
N$24  (via drill 0.61)
  Top 0.254: v61.79,45.28 72.16,45.28 R5.1
  Route2 0.254: v61.79,45.28 59.96,45.28 58.34,43.65 44.01,43.65 43.1,42.74 DRV1.1
N$25  (via drill 0.61)
  Top 0.254: v18.41,46.8 15.46,46.8 R6.1
  Route2 0.254: v18.41,46.8 21.15,49.54 33.24,49.54 DRV2.6
N$26
  Top 0.254: IC3.6 141.14,47.21 141.45,47.21 144.9,50.66 C40.1
N$27
  Top 0.254: IC3.5 141.14,46.49 143.28,46.49 144.6,47.82 C40.2
N$28  (via drill 0.61)
  Top 0.254: v16.28,51.07 15.46,51.07 R7.1
  Route2 0.254: v16.28,51.07 12.11,51.07 7.64,46.6 U$4.G
  Route15 0.254: DRV2.4 38.12,49.75 37.61,49.75 36.7,48.83 18.61,48.83 16.68,50.76 v16.28,51.07
N$29
  Top 0.254: R8.1 72.16,43.34 58.64,43.34 58.34,43.65 48.69,43.65 48.18,44.16 35.07,44.16 34.26,43.34 DRV2.1
N$30  (via drill 0.61)
  Top 0.254: v15.06,36.54 15.06,35.73 R9.1
  Route2 0.254: v15.06,36.54 32.84,36.54 38.12,31.25 DRV3.6
N$31
  Top 0.254: IC3.2 141.14,44.56 143.07,44.56 144.6,43.04 C39.2
N$32
  Top 0.254: IC3.12 135.35,46.49 136.27,46.49 137.18,45.58 137.18,44.77 136.37,43.95 135.35,43.95 IC3.16 134.44,43.85 132.91,43.85 130.78,41.72 R40.1 130.78,40.3 131.29,39.79 131.29,36.13 131.08,35.93 128.95,35.93 128.24,36.64 128.24,53.91 133.42,59.09 135.96,59.09 136.16,58.89 136.16,57.57 135.86,57.26 135.66,57.26 IC2.2
N$34  (via drill 0.61)
  Top 0.254: v13.94,38.06 13.94,38.88 R10.1
  Route2 0.254: v13.94,38.06 10.59,38.06 7.64,35.12 U$5.G
  Route15 0.254: DRV3.4 33.04,31.25 24.51,31.25 18,37.76 14.35,37.76 v13.94,38.06
N$35
  Top 0.254: R11.1 50.01,38.57 48.18,40.4 47.06,40.4 46.25,39.59 46.25,37.35 45.64,36.74 40.25,36.74 39.34,37.66 DRV3.1
N$36  (via drill 0.61)
  Top 0.254: v15.06,21.6 15.06,22.42 R12.1
  Route15 0.254: v15.06,21.6 18.41,21.6 26.64,29.83 46.25,29.83 47.06,30.64 DRV4.6
N$39  (via drill 0.61)
  Top 0.254: v16.28,27.9 15.46,27.9 R13.1
  Route2 0.254: U$6.G 7.64,23.74 11.81,27.9 v16.28,27.9 16.68,28.21 37.61,28.21 40.05,30.64 41.98,30.64 DRV4.4
N$40
  Top 0.254: R14.1 72.16,35.73 58.64,35.73 58.34,36.03 51.94,36.03 50.41,37.55 48.18,37.55 DRV4.1
N$41
  Top 0.508: Q1.1 104.77,57.26 T1.C 105.18,55.54 112.8,55.54 R23.1
N$42
  Top 0.254: R37.1 101.82,52.79 103.35,52.79 T1.B 103.35,52.08 103.35,49.54 R38.1
N$43  (via drill 0.61)
  Top 0.305: 103.35,47.31 102.33,47.31 99.79,49.85 99.79,55.64 104.06,59.91 106.29,59.91 106.8,59.4 Q1.2 | 103.35,47.31 107.21,47.31 108.53,48.63 108.53,51.88 D2.C | v106.19,38.77 106.09,38.77 103.35,41.52 103.35,47.31
  Bottom 0.305: v106.19,38.77 104.36,36.94 103.25,36.94 IC1.9
N$44
  Top 0.254: IC3.1 140.23,43.85 140.23,39.28 138.2,37.25 T2.C 137.38,37.35 133.62,37.35 R39.1
N$45  (via drill 0.61)
  Top 0.508: v98.78,54.22 98.78,53.4 R37.2
  Route2 0.508: v98.78,54.22 108.22,54.22 120.62,66.61 124.48,66.61 125.19,65.9 125.19,41.52 124.18,40.5 SV2.19
N$46
  Top 0.254: T2.B 138.3,40.3 138.3,40.6 136.77,42.13 133.83,42.13 133.62,41.92 R40.2
OC0
  Route15 0.254: SV2.9 123.46,27.8 123.46,28.21 122.55,29.12 122.55,50.56 121.84,51.27 120.72,51.27 120.01,51.98 120.01,75.86 120.82,76.67 120.82,77.28 121.64,78.09 127.32,78.09 128.34,77.08 U$8.4
OC1
  Route2 0.254: SV2.10 121.94,27.5 122.35,27.5 123.26,28.41 124.38,28.41 131.9,35.93 131.9,66.81 141.14,76.06 141.14,77.28 140.33,78.09 134.64,78.09 133.62,77.08 U$8.3
OC2  (via drill 0.61)
  Route2 0.254: v130.88,65.9 130.88,36.64 124.38,30.14 SV2.11
  Route15 0.254: v130.88,65.9 130.88,70.78 135.86,75.76 U$8.2
OC3
  Route2 0.254: SV2.12 121.94,30.04 122.35,30.04 123.26,30.95 124.38,30.95 129.87,36.44 129.87,66.31 139.31,75.76 U$8.1
OC4
  Route15 0.254: SV2.13 124.18,31.56 124.18,31.15 127.53,27.8 127.53,3.62 126.72,2.81 56.51,2.81 46.15,13.17 46.15,21.3 47.16,22.31 K1.1
OC5
  Top 0.254: SV2.14 120.62,31.86 111.68,31.86 82.11,61.43 50.92,61.43 48.59,63.77 K2.1
R1P1COM
  Top 1.016: K1.P1 28.57,14.29 29.99,14.29 X1.7
R1P1NC
  Top 1.016: K1.O1 33.55,14.29 35.58,14.29 44.12,5.75 X1.8
R1P1NO
  Top 1.016: K1.S1 23.59,14.29 25.01,14.29 33.96,5.35 X1.6
R1P2COM
  Bottom 1.016: K1.P2 28.06,25.16 28.06,49.03 38.27,57.98 44.62,74.64 X2.2
R1P2NC
  Top 1.016: K1.O2 32.23,25.16 32.23,29.12 30.4,30.95 30.4,51.37 39.09,58.79 41.63,66.56 49.7,74.64 X2.1
R1P2NO
  Bottom 1.016: K1.S2 22.98,25.16 22.98,26.68 26.44,30.14 26.44,52.39 30.5,56.45 30.5,59.6 32.84,61.94 33.55,61.94 39.54,67.93 39.54,74.64 X2.3
R2P1COM
  Bottom 1.016: K2.P1 28.06,59.5 28.06,61.43 29.79,63.16 29.79,74.64 X2.5
R2P1NC
  Top 1.016: K2.O1 33.04,59.5 33.04,61.43 34.77,63.16 34.77,74.64 X2.4
R2P1NO
  Bottom 1.016: K2.S1 23.08,59.5 23.08,61.43 24.81,63.16 24.81,74.64 X2.6
R2P2COM
  Top 1.016: K2.P2 26.74,66.61 25.22,66.61 15.57,76.26 X2.8
R2P2NC
  Top 1.016: K2.O2 31.72,66.61 30.2,66.61 20.64,76.16 X2.7
R2P2NO
  Top 1.016: K2.S2 21.66,66.51 19.12,66.51 10.49,75.15 X2.9
ROTB
  Top 0.254: IC2.3 135.66,55.94 135.86,56.15 135.96,56.15 136.67,56.86 136.67,59.09 136.16,59.6 125.09,59.6 124.38,58.89 122.85,58.89 121.94,57.98 SV2.34
SPARE0  (via drill 0.61)
  Top 0.254: 79.37,26.68 R32.1 | 79.37,26.68 R33.1 | v79.27,26.68 79.37,26.68
  Route2 0.254: v79.27,26.68 74.09,31.86 58.44,31.86 SV1.13
SPARE1  (via drill 0.61)
  Top 0.254: 83.23,26.68 83.23,27.5 R34.1 | 83.23,26.68 83.23,25.46 R31.1 | v83.13,26.68 83.23,26.68
  Route2 0.254: v83.13,26.68 76.32,33.49 57.22,33.49 56.31,32.58 55.9,32.58 SV1.14
SPARE2
  Top 0.254: R35.1 R30.1 86.08,23.94 85.57,23.43 78.15,23.43 67.18,34.4 58.44,34.4 SV1.15
SPARE3  (via drill 0.61)
  Top 0.254: 90.85,26.68 90.85,27.5 R36.1 | 90.85,26.68 90.85,25.46 R29.1 | v90.75,26.68 90.85,26.68
  Route15 0.254: v90.75,26.68 89.73,27.7 69.11,27.7 63.32,33.49 57.22,33.49 56.31,34.4 55.9,34.4 SV1.16
V12
  Top 0.508: D1.C 114.52,67.63 114.52,59.8 R23.2 112.8,58.38 110.16,58.38 Q1.3 109.04,59.4 108.83,59.4 105.38,62.85 66.67,62.85 58.95,70.57 56.61,70.57 55.9,69.86 C10.2 55.19,68.24 55.19,65.9 SV1.40
  Route15 0.508: K1.2 48.08,16.62 48.08,21.3 49.2,22.42 49.2,55.44 47.98,56.66 K2.2 48.08,58.38 54.58,64.88 SV1.40
VDD  (via drill 0.61)
  Top 0.305: R36.2 89.83,31.15 87.9,31.15 R35.2 86.08,31.15 84.14,31.15 R34.2 82.21,31.15 81.4,31.15 | C37.1 96.34,15.91 94.2,15.91 R24.2 92.48,16.62 v90.85,18.25 | 81.4,31.15 80.28,31.15 R33.2 | v81.4,31.05 81.4,31.15 | 133.62,44.56 132.3,44.56 C43.1 130.58,44.16 128.75,42.33 128.75,39.89 129.26,39.38 129.26,38.16 R39.2 | 133.62,44.56 134.44,44.56 IC3.15 | D2.A 113.71,53.2 113.71,53.71 120.01,60.01 120.01,63.66 120.92,64.58 SV2.40 | C9.2 121.23,68.24 121.23,65.9 SV2.40 | 138.4,58.79 133.22,63.97 122.85,63.97 121.94,64.88 SV2.40 | 138.4,58.79 138.7,58.48 139.92,58.48 IC2.8 | v133.62,44.97 133.62,44.56 | 138.4,58.79 v138.3,58.69
  Route2 0.305: v90.85,18.25 84.14,24.96 84.14,28.31 | 84.14,28.31 v81.4,31.05 | v133.62,44.97 137.28,48.63 137.28,57.67 v138.3,58.69 | 84.14,28.31 84.25,28.41 84.75,28.41 120.92,64.58 SV2.40